# EasyEDA Pro project 2025-06-28（请勿使用）.epro, schematic Schematic1
Create Date: 2025-06-25; Page Name: P1; Project Name: ESP32S3-RS485-魔方机器人摄像头; Schematic Name: Schematic1; Update Date: 2025-06-27; Company: 嘉立创EDA; Page Size: A3; Version: V1.0
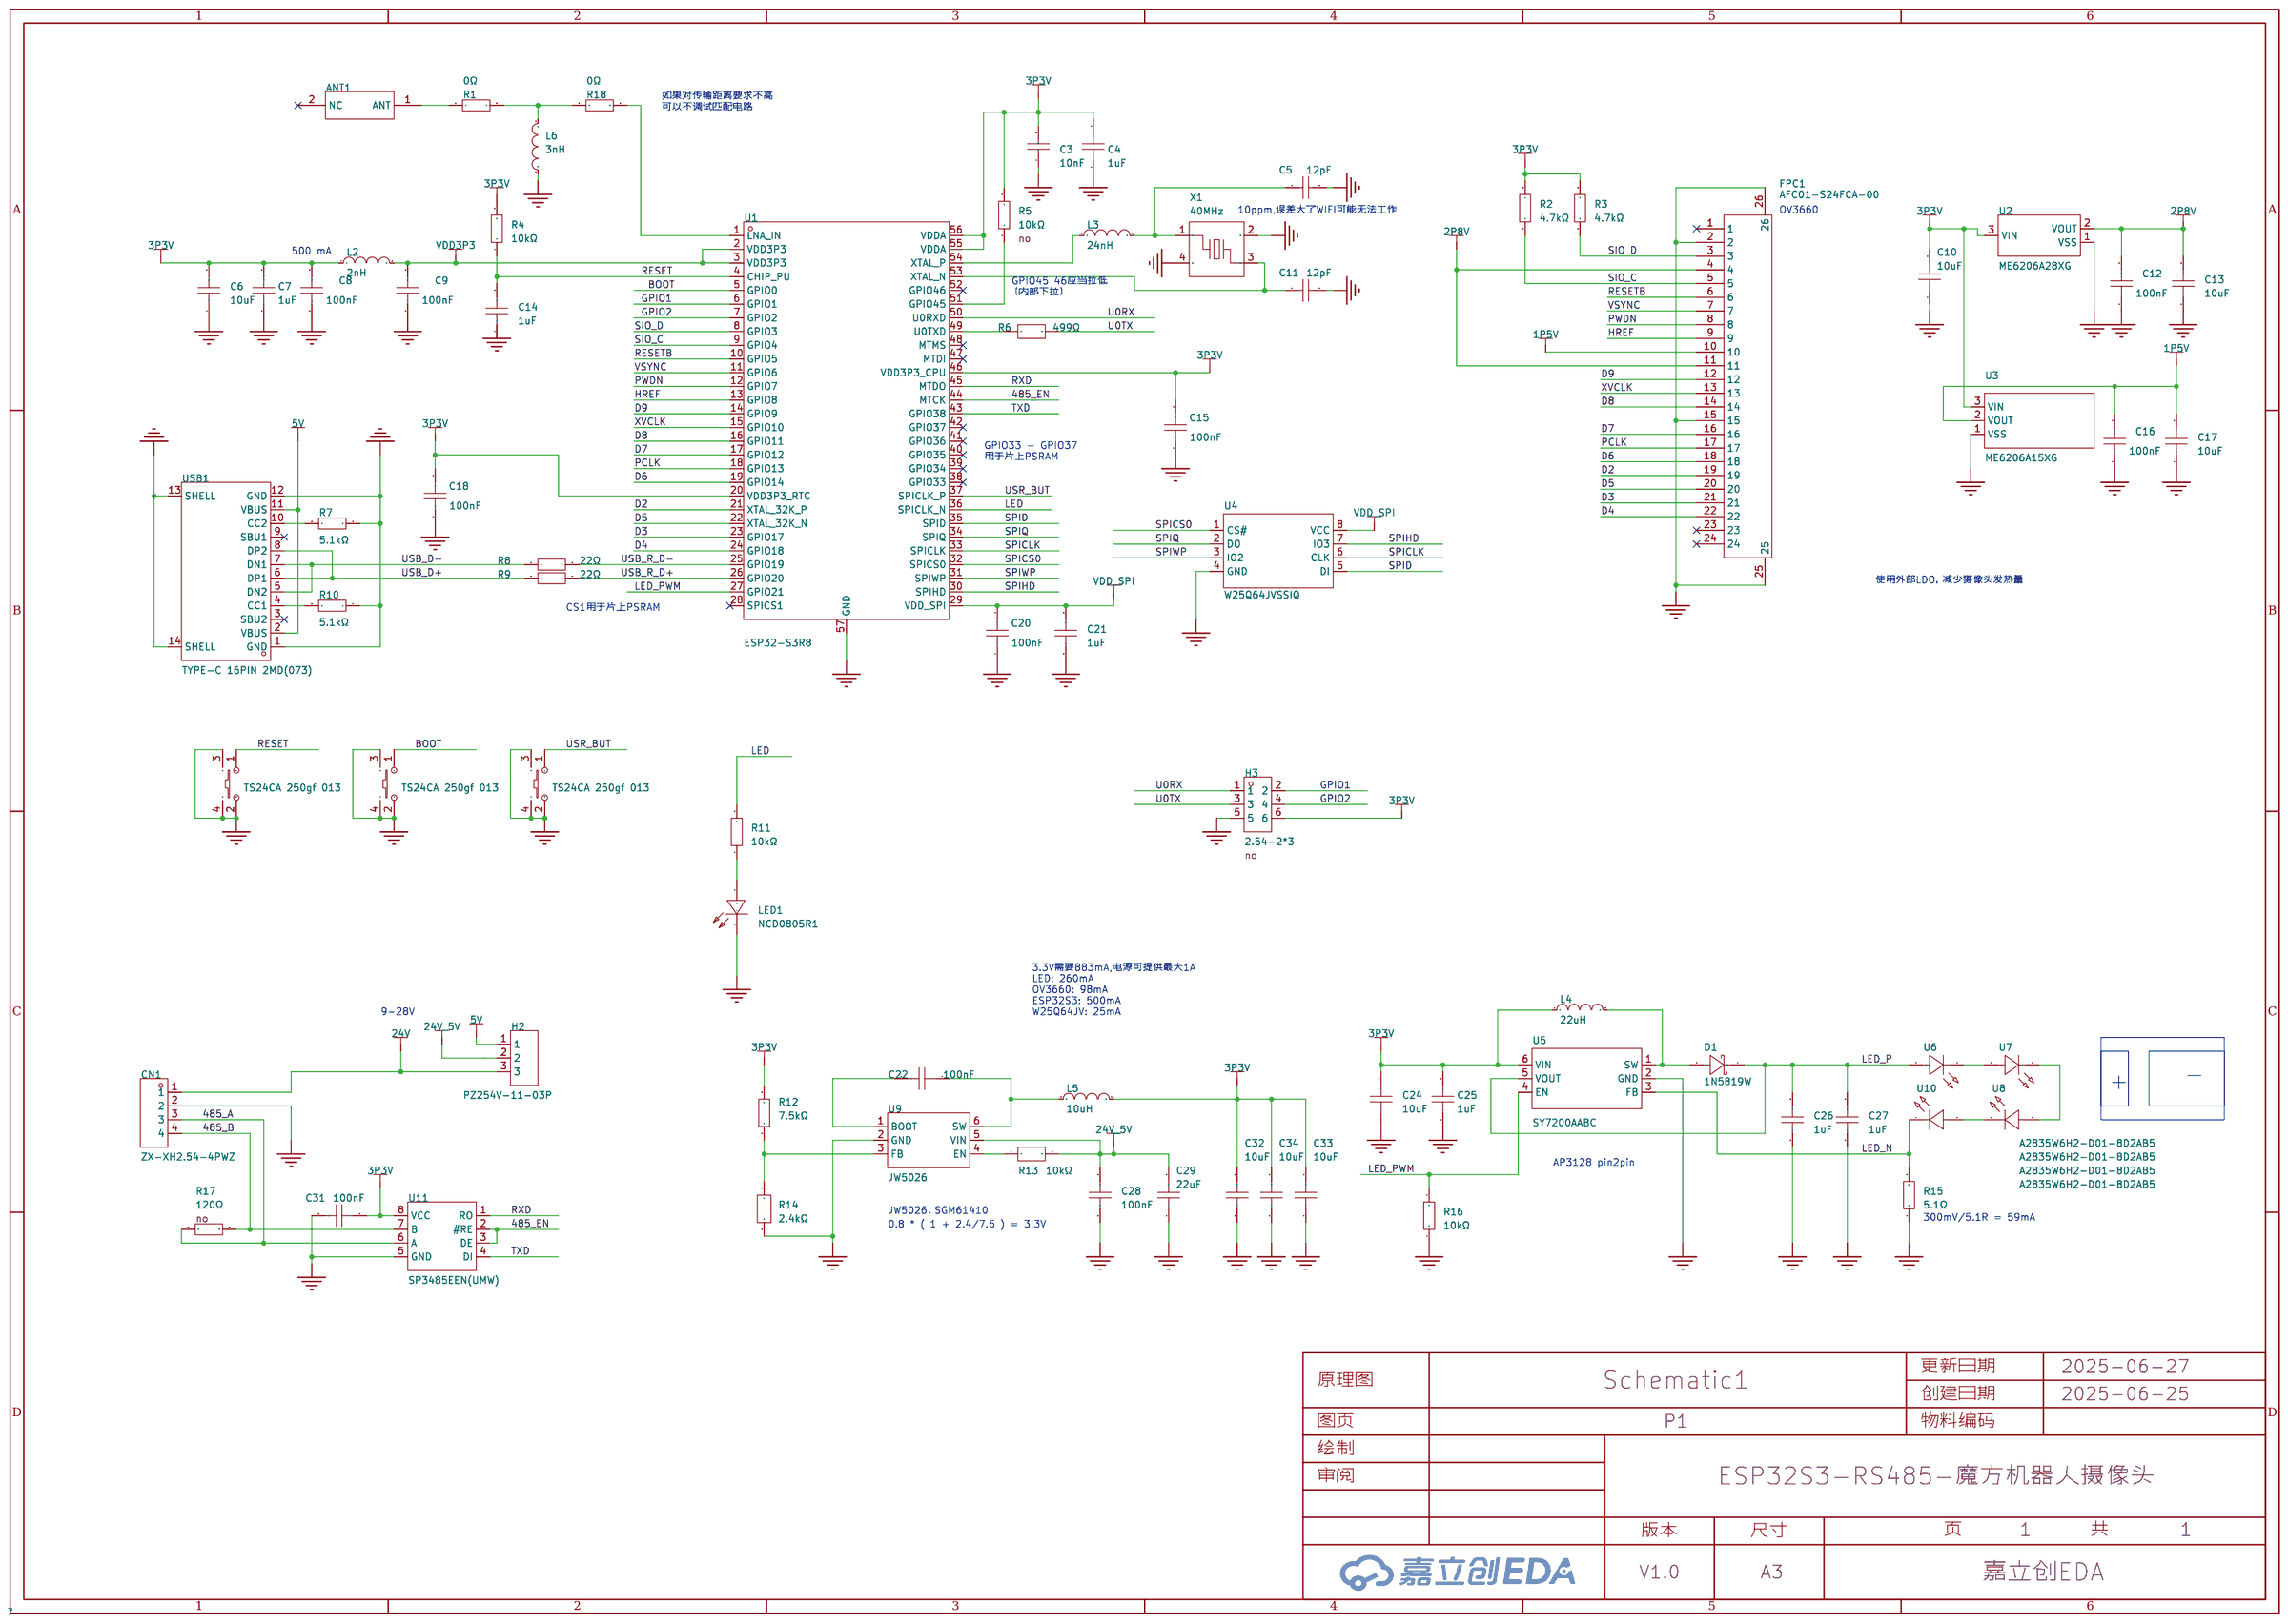
[diagram p0: schematic sheet]

## Parts
ANT1  -  [CA-C03]
C3  10nF  [C0603]
C4  1uF  [C0603]
C5  12pF  [C0603]
C6  10uF  [C0603]
C7  1uF  [C0603]
C8  100nF  [C0603]
C9  100nF  [C0603]
C10  10uF  [C0603]
C11  12pF  [C0603]
C12  100nF  [C0603]
C13  10uF  [C0603]
C14  1uF  [C0603]
C15  100nF  [C0603]
C16  100nF  [C0603]
C17  10uF  [C0603]
C18  100nF  [C0603]
C20  100nF  [C0603]
C21  1uF  [C0603]
C22  100nF  [C0603]
C24  10uF  [C0603]
C25  1uF  [C0603]
C26  1uF  [C0603]
C27  1uF  [C0603]
C28  100nF  [C0603]
C29  22uF  [C0805]
C31  100nF  [C0603]
C32  10uF  [C0603]
C33  10uF  [C0603]
C34  10uF  [C0603]
CN1  ZX-XH2.54-4PWZ  [CONN-TH_4P-P2.50_ZX-XH2.54-4PWZ]
D1  1N5819W  [SOD-123_L2.7-W1.6-LS3.7-RD]
FPC1  AFC01-S24FCA-00  [FPC-SMD_24P-P0.50_AFC01-S24FCA-00]
H2  PZ254V-11-03P  [HDR-TH_3P-P2.54-V-M]
H3  2.54-2*3  [HDR-TH_6P-P2.54-V-R2-C3-S2.54_A2541WV-2X3P]  (no BOM)
L2  2nH  [L0603]
L3  24nH  [IND-SMD_L1.6-W0.8]
L4  22uH  [IND-SMD_L4.0-W4.0]
L5  10uH  [IND-SMD_L4.0-W4.0_FNR40XXS]
L6  3nH  [L0402]
LED1  NCD0805R1  [LED0805-R-RD]
R1  0Ω  [R0402]
R2  4.7kΩ  [R0603]
R3  4.7kΩ  [R0603]
R4  10kΩ  [R0603]
R5  10kΩ  [R0603]  (no BOM)
R6  499Ω  [R0603]
R7  5.1kΩ  [R0603]
R8  22Ω  [R0603]
R9  22Ω  [R0603]
R10  5.1kΩ  [R0603]
R11  10kΩ  [R0603]
R12  7.5kΩ  [R0603]
R13  10kΩ  [R0603]
R14  2.4kΩ  [R0603]
R15  5.1Ω  [R0603]
R16  10kΩ  [R0603]
R17  120Ω  [R0603]  (no BOM)
R18  0Ω  [R0402]
SW1  TS24CA 250gf 013  [SW-SMD_L4.7-W3.5-P3.35-EH]
SW2  TS24CA 250gf 013  [SW-SMD_L4.7-W3.5-P3.35-EH]
SW3  TS24CA 250gf 013  [SW-SMD_L4.7-W3.5-P3.35-EH]
U1  ESP32-S3R8  [QFN-56_L7.0-W7.0-P0.40-TL-EP4.0]
U2  ME6206A28XG  [SOT-23_L2.9-W1.3-P1.90-LS2.4-BR]
U3  ME6206A15XG  [SOT-23-3_L2.9-W1.6-P1.90-LS2.8-BR]
U4  W25Q64JVSSIQ  [SOP-8_L5.3-W5.3-P1.27-LS8.0-BL]
U5  SY7200AABC  [SOT-23-6_L2.9-W1.6-P0.95-LS2.8-BR]
U6  A2835W6H2-D01-8D2AB5  [LED-SMD_L3.5-W2.8-FD-2835_WHITE]
U7  A2835W6H2-D01-8D2AB5  [LED-SMD_L3.5-W2.8-FD-2835_WHITE]
U8  A2835W6H2-D01-8D2AB5  [LED-SMD_L3.5-W2.8-FD-2835_WHITE]
U9  JW5026  [SOT-23-6_L2.9-W1.6-P0.95-LS2.8-BR]
U10  A2835W6H2-D01-8D2AB5  [LED-SMD_L3.5-W2.8-FD-2835_WHITE]
U11  SP3485EEN(UMW)  [SOP-8_L5.0-W4.0-P1.27-LS6.0-BL]
USB1  TYPE-C 16PIN 2MD(073)  [USB-C-SMD_TYPE-C-6PIN-2MD-073]
X1  40MHz  [CRYSTAL-SMD_4P-L3.2-W2.5-BL_SIT8008BI]

## Library data of the parts
ANT1 = CA-C03
C3 = 0603B103K500NT: 容值:10nF;精度:±10%;额定电压:50V;温度系数:X7R;; LCSC Part Name: 10nF ±10% 50V; Supplier Part: C57112; Manufacturer: FH(风华); Supplier Footprint: 0603; JLCPCB Part Class: 基础库; Datasheet: https://atta.szlcsc.com/upload/public/pdf/source/20200305/C486355_26A10D38EF8C2A5C37091D0039909270.pdf; Supplier: LCSC; Tolerance: ±10%; Voltage Rating: 50V; Temperature Coefficient: X7R
C4 C7 C14 C21 C25-C27 = CL10A105KB8NNNC: 容值:1uF;精度:±10%;额定电压:50V;材质(温度系数):X5R;; LCSC Part Name: 1uF ±10% 50V; Supplier Part: C15849; Manufacturer: SAMSUNG(三星); Supplier Footprint: 0603; JLCPCB Part Class: 基础库; Datasheet: https://atta.szlcsc.com/upload/public/pdf/source/20160218/1457707763339.pdf; Supplier: LCSC; Tolerance: ±10%; Voltage Rated: 50V; Temperature Coefficient: X5R
C5 C11 = CL10C120JB8NNNC: 容值:12pF;精度:±5%;额定电压:50V;材质(温度系数):C0G;; LCSC Part Name: 12pF ±5% 50V; Supplier Part: C38523; Manufacturer: SAMSUNG(三星); Supplier Footprint: 0603; JLCPCB Part Class: 基础库; Datasheet: https://atta.szlcsc.com/upload/public/pdf/source/20160218/1457707763339.pdf; Supplier: LCSC; Tolerance: ±5%; Voltage Rated: 50V; Temperature Coefficient: C0G
C6 C10 C13 C17 C24 C32-C34 = CL10A106KP8NNNC: 容值:10uF;精度:±10%;额定电压:10V;材质(温度系数):X5R;; LCSC Part Name: 10uF ±10% 10V; Supplier Part: C19702; Manufacturer: SAMSUNG(三星); Supplier Footprint: 0603; JLCPCB Part Class: 基础库; Datasheet: https://atta.szlcsc.com/upload/public/pdf/source/20160218/1457707763339.pdf; Supplier: LCSC; Tolerance: ±10%; Voltage Rated: 10V; Temperature Coefficient: X5R
C8 C9 C12 C15 C16 C18 C20 C22 C28 C31 = CC0603KRX7R9BB104: 容值:100nF;精度:±10%;额定电压:50V;材质(温度系数):X7R;; LCSC Part Name: 100nF ±10% 50V; Supplier Part: C14663; Manufacturer: YAGEO(国巨); Supplier Footprint: 0603; Datasheet: https://atta.szlcsc.com/upload/public/pdf/source/20180910/C282072_33301C7F631E79921B82A8DAC6BCC5B3.pdf; Supplier: LCSC; Tolerance: ±10%; Voltage Rated: 50V; Temperature Coefficient: X7R
C29 = CGA0805X5R226M350MT: 容值:22uF;精度:±20%;额定电压:35V;材质(温度系数):X5R;; LCSC Part Name: 22uF ±20% 35V; Supplier Part: C6119901; Manufacturer: HRE(芯声); Supplier Footprint: 0805; JLCPCB Part Class: 扩展库; Datasheet: https://atta.szlcsc.com/upload/public/pdf/source/20231129/D589D0CC4D260F7AC3A77E53B455CCB3.pdf; Supplier: LCSC; Tolerance: ±20%; Voltage Rated: 35V; Temperature Coefficient: X5R
CN1 = ZX-XH2.54-4PWZ: 插针结构:1x4P;间距:2.5mm;安装方式:弯插;参考系列:XH;总PIN数:4P;排数:1;每排PIN数:4;行距:-;额定电流:3A;触头材质:黄铜;触头镀层:锡;工作温度范围:-25℃~+85℃;; LCSC Part Name: 1x4P 间距:2.5mm 弯插 系列:XH; Supplier Part: C7429643; Manufacturer: Megastar(兆星); Supplier Footprint: 弯插,P=2.5mm; JLCPCB Part Class: 扩展库; Datasheet: https://atta.szlcsc.com/upload/public/pdf/source/20230619/8DC602C7BA46C153FF1BE89D90453879.pdf; Supplier: LCSC; Pins Structure: 1x4P; Pitch: 2.5mm; Mounting Type: 弯插; Reference Series: XH; Number of Pins: 4P; Number of Rows: 1; Number of PINs Per Row: 4; Rated Current: 3A; Contact Material: 黄铜; Contact Plating: 锡; Operating Temperature: -25℃~+85℃; Rated Voltage (Max): 250V; Plastic Material: PA66; Flame Retardant Rating: UL94V-0; Color: 白色; Z-Height of the Board: 5.9mm; X-Length of Bottom Edge on Board (Spacing Line): 12.5mm; Y-Width of Bottom Edge on Board: 7.32mm
D1 = 1N5819W_C963381: 二极管配置:独立式;正向压降(Vf):600mV@200mA;直流反向耐压(Vr):40V;整流电流:350mA;; LCSC Part Name: 电压:40V 电流:350mA; Supplier Part: C963381; Manufacturer: JSMSEMI(杰盛微); Supplier Footprint: SOD-123; JLCPCB Part Class: 扩展库; Datasheet: https://atta.szlcsc.com/upload/public/pdf/source/20230807/ADD53622154D5B572F84A7B877E922CE.pdf; Supplier: LCSC; Diode Configuration: 独立式; Forward Voltage (Vf@If): 600mV@200mA; Reverse Voltage (Vr): 40V; Rectified Current: 350mA; Reverse Leakage Current (Ir): 5uA@30V
FPC1 = AFC01-S24FCA-00: 锁定特性:翻盖式;触点类型:下接;触点数量:24P;间距:0.5mm;安装类型:卧贴;; LCSC Part Name: 间距:0.5mm P数:24P 翻盖式 下接; Supplier Part: C262669; Manufacturer: JS(钜硕电子); Supplier Footprint: SMD,P=0.5mm,卧贴; JLCPCB Part Class: 扩展库; Datasheet: https://atta.szlcsc.com/upload/public/pdf/source/20190816/C413942_2A72D1AC756EAE17EEDF756A339D4500.pdf; Supplier: LCSC; Locking Feature: 翻盖式; Contact Type: 下接; Number of Contacts: 24P; Pitch: 0.5mm; Mounting Type: 卧贴; FFC, FCB Thickness: 0.3mm; Height Above Board: 2mm
H2 = PZ254V-11-03P: 插针结构:1x3P;间距:2.54mm;行距:-;圆针/方针:方针;安装方式:直插;排数:单排;总PIN位数:3P;额定电流:3A;额定电压:250V;配合针长度:6mm;塑高:2.5mm;端接针长度:3mm;工作温度:-40℃~+105℃;颜色:黑色;; LCSC Part Name: 1x3P 间距:2.54mm 方针 直插; Supplier Part: C2937625; Manufacturer: XFCN(兴飞); Supplier Footprint: 插件,P=2.54mm; JLCPCB Part Class: 扩展库; Datasheet: https://atta.szlcsc.com/upload/public/pdf/source/20200309/C492402_8335C3D49C4E4C618838D59BB1D024C1.pdf; Supplier: LCSC; Pin Structure: 1x3P; Pitch: 2.54mm; Circluar Pins/Square Pins: 方针; Mounting Type: 直插; Number of Rows: 单排; Number of Pins: 3P; Current Rating: 3A; Voltage Rating (Max): 250V; Length of Mating Pin: 6mm; Insulation Height: 2.5mm; Length of End Connection Pin: 3mm; Operating Temperature: -40℃~+105℃; Color: 黑色
H3 = 2.54-2*3: 插针结构:2x3P;间距:2.54mm;排数:双排;总PIN位数:6P;; Supplier Part: C5116479; Manufacturer: ZHOURI(洲日); Supplier Footprint: 插件,P=2.54mm; JLCPCB Part Class: 扩展库; Datasheet: https://atta.szlcsc.com/upload/public/pdf/source/20220729/7A96040568D3A9F25ED0F1D4F891C529.pdf; Supplier: LCSC; Pin Structure: 2x3P; Pitch: 2.54mm; Number of Rows: 双排; Number of Pins: 6P
L2 = SDCL1608C2N0STDF: 电感值:2nH;额定电流:-;饱和电流(Isat):-;直流电阻(DCR):-;; Supplier Part: C370234; Manufacturer: Sunlord(顺络); Supplier Footprint: 0603; JLCPCB Part Class: 扩展库; Datasheet: https://atta.szlcsc.com/upload/public/pdf/source/20231027/6126A3AAC5912C34388756BE22DEE00C.pdf; Supplier: LCSC
L3 = LQW18AN24NG00D: 电感值:24nH;精度:±2%;额定电流:500mA;饱和电流(Isat):-;; LCSC Part Name: 24nH ±2%; Supplier Part: C162644; Manufacturer: muRata(村田); Supplier Footprint: 0603; JLCPCB Part Class: 扩展库; Datasheet: https://atta.szlcsc.com/upload/public/pdf/source/20180509/C162644_55649592C41EA1D19E6A8BFE8B8D1EC5.pdf; Supplier: LCSC; Tolerance: ±2%; Rated Current: 500mA; DC Resistance (DCR): 210mΩ
L4 = FHD4020S-220MT: 电感值:22uH;精度:±20%;额定电流:1.1A;饱和电流(Isat):1.5A;; LCSC Part Name: 22uH ±20% 1.5A; Supplier Part: C843299; Manufacturer: cjiang(长江微电); Supplier Footprint: SMD,4x4mm; JLCPCB Part Class: 扩展库; Datasheet: https://atta.szlcsc.com/upload/public/pdf/source/20200609/C601990_BCEA243EC4DA0A9A288AA78A6DFB48A5.pdf; Supplier: LCSC; Tolerance: ±20%; Rated Current: 1.1A; Saturation Current (Isat): 1.5A; DC Resistance (DCR): 415mΩ
L5 = FNR4030S100MT: 电感值:10uH;精度:±20%;额定电流:1.6A;饱和电流(Isat):2.4A;类型:磁胶屏蔽绕线合金电感;; LCSC Part Name: 10uH ±20% 2.4A; Supplier Part: C167879; Manufacturer: cjiang(长江微电); Supplier Footprint: SMD,4x4mm; JLCPCB Part Class: Extended Part; Datasheet: https://atta.szlcsc.com/upload/public/pdf/source/20190327/C167925_9EFF0AABC4CA629C2CC95961DBF7D39D.pdf; Supplier: LCSC; Tolerance: ±20%; Current Rating: 1.6A; Current - Saturation(Isat): 2.4A; DC Resistance(DCR): 130mΩ; Type: 磁胶屏蔽绕线合金电感; Rated Current: 1.1A; Saturation Current (Isat): 1.5A; DC Resistance (DCR): 415mΩ
L6 = LQG15HS3N0S02D: 电感值:3nH;精度:-;额定电流:800mA;饱和电流(Isat):-;直流电阻(DCR):125mΩ;; LCSC Part Name: 3nH ±0.3nH; Supplier Part: C19898; Manufacturer: muRata(村田); Supplier Footprint: 0402; JLCPCB Part Class: 扩展库; Datasheet: https://atta.szlcsc.com/upload/public/pdf/source/20190308/C133049_B485E2EE8D2287FEC07A8B24C0CCAD4A.pdf; Supplier: LCSC; Rated Current: 800mA; DC Resistance (DCR): 125mΩ; Q @ Freq: 8@100MHz; Frequency - Self Resonant: 6GHz
LED1 = NCD0805R1: 灯头类型:-;发光颜色:红色;正向电压(VF):1.6V~2.6V;功率:65mW;正向电流:20mA;主波长:615nm~630nm;二极管配置:独立二极管;透镜颜色:无色透明透镜;色温:-;发光强度:67mcd~195mcd;发光角度:130°;载带方式:-;工作温度:-30℃~+85℃;; Supplier Part: C84256; Manufacturer: 国星光电; Supplier Footprint: 0805; JLCPCB Part Class: 基础库; Datasheet: https://atta.szlcsc.com/upload/public/pdf/source/20200820/C84256_F0A75A43B3EAD75808600A0514C76B99.pdf; Supplier: LCSC; Emitted Color: 红色; Forward Voltage (VF): 1.6V~2.6V; Power Dissipation: 65mW; Forward Current: 20mA; Dominant Wavelength: 615nm~630nm; Diode Configuration: 独立二极管; Lens Color: 无色透明透镜; Luminous Intensity: 67mcd~195mcd; Viewing Angle: 130°; Operating Temperature: -30℃~+85℃
R1 R18 = 0402WGF0000TCE: 电阻类型:厚膜电阻;阻值:0Ω;精度:±1%;功率:62.5mW;最大工作电压:50V;温度系数:±800ppm/℃;; LCSC Part Name: 0Ω ±1% 62.5mW 厚膜电阻; Supplier Part: C17168; Manufacturer: UNI-ROYAL(厚声); Supplier Footprint: 0402; JLCPCB Part Class: 基础库; Datasheet: https://atta.szlcsc.com/upload/public/pdf/source/20200306/C422600_1E6D84923E4A46A82E41ADD87F860B5C.pdf; Supplier: LCSC; Type: 厚膜电阻; Tolerance: ±1%; Power(Watts): 62.5mW; Overload Voltage (Max): 50V; Temperature Coefficient: ±800ppm/℃; Operating Temperature Range: -55℃~+155℃
R2 R3 = 0603WAF4701T5E: 电阻类型:厚膜电阻;阻值:4.7kΩ;精度:±1%;功率:100mW;最大工作电压:75V;温度系数:±100ppm/℃;; LCSC Part Name: 4.7kΩ ±1% 100mW 厚膜电阻; Supplier Part: C23162; Manufacturer: UNI-ROYAL(厚声); Supplier Footprint: 0603; JLCPCB Part Class: 基础库; Datasheet: https://atta.szlcsc.com/upload/public/pdf/source/20200306/C422600_1E6D84923E4A46A82E41ADD87F860B5C.pdf; Supplier: LCSC; Type: 厚膜电阻; Tolerance: ±1%; Power(Watts): 100mW; Overload Voltage (Max): 75V; Temperature Coefficient: ±100ppm/℃; Operating Temperature Range: -55℃~+155℃
R4 R5 R11 R16 = 0603WAF1002T5E: 电阻类型:厚膜电阻;阻值:10kΩ;精度:±1%;功率:100mW;工作电压:75V;温度系数:±100ppm/℃;; LCSC Part Name: 厚膜电阻 10kΩ ±1% 100mW; Supplier Part: C25804; Manufacturer: UNI-ROYAL(厚声); Supplier Footprint: 0603; JLCPCB Part Class: 基础库; Datasheet: https://atta.szlcsc.com/upload/public/pdf/source/20200306/C422600_1E6D84923E4A46A82E41ADD87F860B5C.pdf; Supplier: LCSC; Type: 厚膜电阻; Tolerance: ±1%; Power(Watts): 100mW; Voltage-Supply(Max): 75V; Temperature Coefficient: ±100ppm/℃; Operating Temperature: -55℃~+155℃
R6 = FRC0603F4990TS: 电阻类型:厚膜电阻;阻值:499Ω;精度:±1%;功率:100mW;工作电压:75V;温度系数:±100ppm/℃;; LCSC Part Name: 499Ω ±1% 100mW 厚膜电阻; Supplier Part: C2933227; Manufacturer: FOJAN(富捷); Supplier Footprint: 0603; JLCPCB Part Class: 扩展库; Datasheet: https://atta.szlcsc.com/upload/public/pdf/source/20211221/925EC7D7225764EE0046F22065062C87.pdf; Supplier: LCSC; Type: 厚膜电阻; Tolerance: ±1%; Power(Watts): 100mW; Overload Voltage (Max): 75V; Temperature Coefficient: ±100ppm/℃; Operating Temperature: -55℃~+155℃
R7 R10 = 0603WAF5101T5E: 阻值:5.1kΩ;精度:±1%;功率:100mW;温度系数:±100ppm/℃;电阻类型:厚膜电阻;; LCSC Part Name: 5.1kΩ ±1% 100mW 厚膜电阻; Supplier Part: C23186; Manufacturer: UNI-ROYAL(厚声); Supplier Footprint: 0603; Datasheet: https://atta.szlcsc.com/upload/public/pdf/source/20200306/C422600_1E6D84923E4A46A82E41ADD87F860B5C.pdf; Supplier: LCSC; Tolerance: ±1%; Power(Watts): 100mW; Overload Voltage (Max): 75V; Temperature Coefficient: ±100ppm/℃; Type: 厚膜电阻; Operating Temperature Range: -55℃~+155℃
R8 R9 = 0603WAF220JT5E: 电阻类型:厚膜电阻;阻值:22Ω;精度:±1%;功率:100mW;最大工作电压:75V;温度系数:±100ppm/℃;; LCSC Part Name: 22Ω ±1% 100mW 厚膜电阻; Supplier Part: C23345; Manufacturer: UNI-ROYAL(厚声); Supplier Footprint: 0603; JLCPCB Part Class: Basic Part; Datasheet: https://atta.szlcsc.com/upload/public/pdf/source/20200306/C422600_1E6D84923E4A46A82E41ADD87F860B5C.pdf; Supplier: LCSC; Type: 厚膜电阻; Tolerance: ±1%; Power(Watts): 100mW; Overload Voltage (Max): 75V; Temperature Coefficient: ±100ppm/℃; Operating Temperature Range: -55℃~+155℃
R12 = 0603WAF7501T5E: 电阻类型:厚膜电阻;阻值:7.5kΩ;精度:±1%;功率:100mW;最大工作电压:75V;温度系数:±100ppm/℃;; LCSC Part Name: 7.5kΩ ±1% 100mW 厚膜电阻; Supplier Part: C23234; Manufacturer: UNI-ROYAL(厚声); Supplier Footprint: 0603; JLCPCB Part Class: Basic Part; Datasheet: https://atta.szlcsc.com/upload/public/pdf/source/20200306/C422600_1E6D84923E4A46A82E41ADD87F860B5C.pdf; Supplier: LCSC; Type: 厚膜电阻; Tolerance: ±1%; Power(Watts): 100mW; Overload Voltage (Max): 75V; Temperature Coefficient: ±100ppm/℃; Operating Temperature Range: -55℃~+155℃
R13 = AT0603BRD0710KL: 电阻类型:薄膜电阻;阻值:10kΩ;精度:±0.1%;功率:100mW;; LCSC Part Name: 10kΩ ±0.1% 100mW; Supplier Part: C723396; Manufacturer: YAGEO(国巨); Supplier Footprint: 0603; JLCPCB Part Class: 扩展库; Datasheet: https://atta.szlcsc.com/upload/public/pdf/source/20200722/C705051_EA338A836C78FCD1C867566BE6F43B3A.pdf; Supplier: LCSC; Type: 薄膜电阻; Tolerance: ±0.1%; Power(Watts): 100mW; Temperature Coefficient: ±25ppm/℃; Overload Voltage (Max): 75V; Operating Temperature Range: -55℃~+155℃
R14 = FRC0603F2401TS: 电阻类型:厚膜电阻;阻值:2.4kΩ;精度:±1%;功率:100mW;工作电压:75V;温度系数:±100ppm/℃;; LCSC Part Name: 2.4kΩ ±1% 100mW 厚膜电阻; Supplier Part: C2907007; Manufacturer: FOJAN(富捷); Supplier Footprint: 0603; JLCPCB Part Class: Extended Part; Datasheet: https://atta.szlcsc.com/upload/public/pdf/source/20211221/925EC7D7225764EE0046F22065062C87.pdf; Supplier: LCSC; Type: 厚膜电阻; Tolerance: ±1%; Power(Watts): 100mW; Voltage-Supply(Max): 75V; Temperature Coefficient: ±100ppm/℃; Operating Temperature: -55℃~+155℃; Overload Voltage (Max): 75V; Operating Temperature Range: -55℃~+155℃
R15 = 0603WAF510KT5E: 电阻类型:厚膜电阻;阻值:5.1Ω;精度:±1%;功率:100mW;最大工作电压:75V;温度系数:±200ppm/℃;; LCSC Part Name: 5.1Ω ±1% 100mW 厚膜电阻; Supplier Part: C25197; Manufacturer: UNI-ROYAL(厚声); Supplier Footprint: 0603; JLCPCB Part Class: 基础库; Datasheet: https://atta.szlcsc.com/upload/public/pdf/source/20200306/C422600_1E6D84923E4A46A82E41ADD87F860B5C.pdf; Supplier: LCSC; Type: 厚膜电阻; Tolerance: ±1%; Power(Watts): 100mW; Overload Voltage (Max): 75V; Temperature Coefficient: ±200ppm/℃; Operating Temperature Range: -55℃~+155℃
R17 = 0603WAF1200T5E: 电阻类型:厚膜电阻;阻值:120Ω;精度:±1%;功率:100mW;最大工作电压:75V;温度系数:±100ppm/℃;; LCSC Part Name: 120Ω ±1% 100mW 厚膜电阻; Supplier Part: C22787; Manufacturer: UNI-ROYAL(厚声); Supplier Footprint: 0603; JLCPCB Part Class: 基础库; Datasheet: https://atta.szlcsc.com/upload/public/pdf/source/20200306/C422600_1E6D84923E4A46A82E41ADD87F860B5C.pdf; Supplier: LCSC; Type: 厚膜电阻; Tolerance: ±1%; Power(Watts): 100mW; Overload Voltage (Max): 75V; Temperature Coefficient: ±100ppm/℃; Operating Temperature Range: -55℃~+155℃
SW1-SW3 = TS24CA 250gf 013: 电路结构:单刀单掷;按钮形状:矩形按钮;作用力:250gf;安装方式:卧贴;开关长度:4.55mm;开关宽度:1.8mm;开关高度:3.5mm;带支架:不带;触点电流:50mA;额定电压(AC):-;额定电压(DC):12V;额定功率:0.6W;绝缘电阻:100MΩ;带灯:无;机械寿命:3万次;; LCSC Part Name: 2*4*3.5mm半包小贝贝TS-018小侧按键m165蓝牙耳机开关 250gf; Supplier Part: C5373430; Manufacturer: SHOU HAN(首韩); Supplier Footprint: SMD; JLCPCB Part Class: 扩展库; Datasheet: https://atta.szlcsc.com/upload/public/pdf/source/20230321/913029B0FB0CD391AF5EFD51697D8EC4.pdf; Supplier: LCSC; Circuit: 单刀单掷; Actuator Style: 矩形按钮; Operating Force: 250gf; Mounting Style: 卧贴; Switch Length: 4.55mm; Switch Width: 1.8mm; Switch Height: 3.5mm; Strike Gundam: 不带; Contact Current: 50mA; Voltage Rating (DC): 12V; Power Rating: 0.6W; Insulation Resistance: 100MΩ; Actuator/Cap Color: 黑色; With Lamp: 无; Mechanical Life: 3万次; Operating Temperature: -40℃~+85℃
U1 = ESP32-S3R8: 频率范围:2.412GHz~2.484GHz;接口类型:I2C；I2S；UART；USB；SPI;应用领域:蓝牙；IoT；WiFi;数据速率:150Mbps;灵敏度:-74.2dBm;典型应用频率:2.4GHz;; Supplier Part: C2913194; Manufacturer: ESPRESSIF(乐鑫); Supplier Footprint: QFN-56(7x7); JLCPCB Part Class: 扩展库; Datasheet: https://atta.szlcsc.com/upload/public/pdf/source/20231007/CDA236FFCB3F25B7D5220D2CA9867287.pdf; Supplier: LCSC; Frequency Range: 2.412GHz~2.484GHz; Interface: I2C；I2S；UART；USB；SPI; Voltage - Supply: 3V~3.6V; Applications: 蓝牙；IoT；WiFi; Output Power: 18.5dBm; Data Rate: 150Mbps; Current Of Transmitting: 283mA; Sensitivity: -74.2dBm; Receive Current: 88mA; Typical Application Frequency: 2.4GHz; Operating Temperature: -40℃~+65℃
U2 = ME6206A28XG: 输出类型:固定;工作电压:6V;输出电压:2.8V;输出电流:300mA;电源纹波抑制比(PSRR):50dB@(1kHz);输出极性:正极;; LCSC Part Name: 输入6V 输出2.8V 300mA; Supplier Part: C236702; Manufacturer: MICRONE(南京微盟); Supplier Footprint: SOT-23; JLCPCB Part Class: Extended Part; Datasheet: https://atta.szlcsc.com/upload/public/pdf/source/20180709/C236710_17D59B8921B23E717C74E2DD8882F2F4.pdf; Supplier: LCSC; Output Type: 固定; Voltage - Supply: 6V; Output Voltage: 2.8V; Output Current: 300mA; Power Supply Rejection Ratio (PSRR): 50dB@(1kHz); Voltage Dropout: 400mV@(200mA); Features: 短路保护(SCP)；过流保护(OCP); Output Configuration: 正极; Number of Outputs: 1
U3 = ME6206A15XG: 输出类型:固定;工作电压:6V;输出电压:1.5V;输出电流:100mA;电源纹波抑制比(PSRR):45dB@(1kHz);输出极性:正极;; LCSC Part Name: 输入6V 输出1.5V 100mA; Supplier Part: C236709; Manufacturer: MICRONE(南京微盟); Supplier Footprint: SOT-23; JLCPCB Part Class: 扩展库; Datasheet: https://atta.szlcsc.com/upload/public/pdf/source/20180709/C236710_17D59B8921B23E717C74E2DD8882F2F4.pdf; Supplier: LCSC; Output Type: 固定; Voltage - Supply: 6V; Output Voltage: 1.5V; Output Current: 100mA; Power Supply Rejection Ratio (PSRR): 45dB@(1kHz); Voltage Dropout: 380mV@(50mA); Features: 短路保护(SCP)；过流保护(OCP); Output Configuration: 正极; Number of Outputs: 1
U4 = W25Q64JVSSIQ_C83140: 接口类型:SPI;存储容量:-;时钟频率(fc):133MHz;; Supplier Part: C83140; Manufacturer: WINBOND(华邦); Supplier Footprint: SOP-8-208mil; JLCPCB Part Class: 扩展库; Datasheet: https://atta.szlcsc.com/upload/public/pdf/source/20161110/1478742546019.pdf; Supplier: LCSC; Interface: SPI; Clock Frequency: 133MHz; Voltage - Supply: 3V~3.6V; Page Programming Time (Tpp): 3ms; Data Retention - TDR (Year): 20年
U5 = SY7200AABC: 开关频率:1MHz;通道数:1;输出电流:2A;调光:PWM;拓扑结构:升压;; Supplier Part: C107309; Manufacturer: silergy(矽力杰); Supplier Footprint: SOT-23-6; JLCPCB Part Class: Extended Part; Datasheet: https://atta.szlcsc.com/upload/public/pdf/source/20170925/C107309_1506321334417990079.pdf; Supplier: LCSC; Frequency - Switching: 1MHz; Number of Channels: 1; Output Current: 2A; Dimming: PWM; Topology: 升压; Operating temperature: -40℃~+85℃; Voltage - Input: 2.5V~5.5V
U6-U8 U10 = A2835W6H2-D01-8D2AB5: 发光颜色:白色;正向电压(VF):2.9V~3.3V;正向电流:-;色温:6500K;; LCSC Part Name: 2835正白光6000-7000K; Supplier Part: C7423447; Manufacturer: HONGLITRONIC(鸿利光电); Supplier Footprint: SMD2835; JLCPCB Part Class: Extended Part; Datasheet: https://atta.szlcsc.com/upload/public/pdf/source/20230608/811871640B6DA35415197D15B0ECD5AB.pdf; Supplier: LCSC; Emitted Color: 白色; Forward Voltage (VF): 2.9V~3.3V; Color Temperature: 6500K
U9 = JW5026: 功能类型:降压型;输出类型:可调;工作电压:4.7V~40V;输出电压:800mV~37V;输出电流:1A;; LCSC Part Name: 40V/1A 1.1MHz 同步降压转换器; Supplier Part: C185109; Manufacturer: Joulwatt(杰华特); Supplier Footprint: SOT-23-6; JLCPCB Part Class: Extended Part; Datasheet: https://atta.szlcsc.com/upload/public/pdf/source/20240411/D05DCDB5FDCEDE426B2091AA7B7ABBD9.pdf; Supplier: LCSC; Function: 降压型; Output Type: 可调; Voltage - Supply: 4.7V~40V; Output Voltage: 800mV~37V; Output Current: 1A; Frequency - Switching: 750kHz~1.25MHz; Operating Temperature: -40℃~+125℃@(TJ); Synchronous Rectifier: 是; Number of Outputs: 1; Topology: 降压式; Switch tube (built-in/external): 内置
U11 = SP3485EEN(UMW): 类型:收发器;数据速率:12Mbps;; LCSC Part Name: SP3485E 3.3V电源，最多256个节点，12Mbps半双工，RS485/RS422收发器; Supplier Part: C668205; Manufacturer: UMW(友台半导体); Supplier Footprint: SOP-8; JLCPCB Part Class: 扩展库; Datasheet: https://atta.szlcsc.com/upload/public/pdf/source/20240223/FED69C9FF7082854C69A701499F648A3.pdf; Supplier: LCSC; Types: 收发器; Number of Driver: 1; Number of receiver: 1; Supply Voltage: 2.97V~3.63V; Data Rate: 12Mbps; Operating Temperature: -40℃~+85℃
USB1 = TYPE-C 16PIN 2MD(073): 连接器类型:Type-C;标准:-;公母:母;触点数量:16P;端口数量:1;安装方式:卧贴;额定电流 - 电源:5A;工作温度范围:-25℃~+85℃;; LCSC Part Name: Type-C 母 卧贴 带定位柱 不锈钢外壳 2次模顶; Supplier Part: C2765186; Manufacturer: SHOU HAN(首韩); Supplier Footprint: SMD; JLCPCB Part Class: 扩展库; Datasheet: https://atta.szlcsc.com/upload/public/pdf/source/20211123/39B17C16241EAC15C5E277BDA434118E.pdf; Supplier: LCSC; Connector Type: Type-C; Gender: 母; Number of Contacts: 16P; Number of Ports: 1; Mounting Style: 卧贴; Current Rating - Power (Max): 5A; Operating Temperature Range: -25℃~+85℃
X1 = CF4040M00010001: 晶振类型:贴片晶振;频率:40MHz;常温频差:±10ppm;负载电容:10pF;频率稳定度:±30ppm;; LCSC Part Name: 40MHz ±10ppm 10pF; Supplier Part: C7294598; Manufacturer: HUAXIN(华昕); Supplier Footprint: SMD3225-4P; JLCPCB Part Class: Extended Part; Datasheet: https://atta.szlcsc.com/upload/public/pdf/source/20230621/E84B4CBBD03DBFE94C04DF39FCA92073.pdf; Supplier: LCSC; Type: 贴片晶振; Normal temperature Frequency Tolerance: ±10ppm; Load Capacitance: 10pF; Frequency Stability: ±30ppm; Equivalent Series Resistance(ESR): 40Ω; Operating Temperature: -40℃~+85℃

## Nets
5V: H2.1 USB1.2(VBUS) USB1.11(VBUS)
24V: CN1.1 H2.3
24V_5V: C28.1 C29.2 H2.2 R13.2 U9.5(VIN)
GND: C3.1 C4.1 C5.2 C6.1 C7.1 C8.1 C9.1 C10.1 C11.1 C12.1 C13.1 C14.1 C15.1 C16.1 C17.1 C18.1 C20.1 C21.1 C24.1 C25.1 C26.1 C27.1 C28.2 C29.1 C31.2 C32.1 C33.1 C34.1 CN1.2 FPC1.2 FPC1.15 FPC1.25 FPC1.26 H3.5 L6.1 LED1.2(-) R7.1 R10.1 R14.1 R15.1 R16.1 SW1.2 SW1.3 SW1.4 SW2.2 SW2.3 SW2.4 SW3.2 SW3.3 SW3.4 U1.57(GND) U2.1(VSS) U3.1(VSS) U4.4(GND) U5.2(GND) U9.2(GND) U11.5(GND) USB1.1(GND) USB1.12(GND) USB1.13(SHELL) USB1.14(SHELL) X1.2(GND) X1.4(GND)
VDD3P3: C9.2 L2.2 U1.2(VDD3P3) U1.3(VDD3P3)
VDD_SPI: C20.2 C21.2 U1.29(VDD_SPI) U4.8(VCC)
1P5V: C16.2 C17.2 FPC1.10 U3.2(VOUT)
2P8V: C12.2 C13.2 FPC1.4 FPC1.11 U2.2(VOUT)
3P3V: C3.2 C4.2 C6.2 C7.2 C8.2 C10.2 C15.2 C18.2 C24.2 C25.2 C31.1 C32.2 C33.2 C34.2 H3.6 L2.1 L4.1 L5.2 R2.2 R3.2 R4.2 R5.2 R12.2 U1.20(VDD3P3_RTC) U1.46(VDD3P3_CPU) U1.55(VDDA) U1.56(VDDA) U2.3(VIN) U3.3(VIN) U5.6(VIN) U11.8(VCC)
485_A: CN1.3 R17.1 U11.6(A)
485_B: CN1.4 R17.2 U11.7(B)
485_EN: U1.44(MTCK) U11.2(#RE) U11.3(DE)
BOOT: SW2.1 U1.5(GPIO0)
D2: FPC1.19 U1.21(XTAL_32K_P)
D3: FPC1.21 U1.23(GPIO17)
D4: FPC1.22 U1.24(GPIO18)
D5: FPC1.20 U1.22(XTAL_32K_N)
D6: FPC1.18 U1.19(GPIO14)
D7: FPC1.16 U1.17(GPIO12)
D8: FPC1.14 U1.16(GPIO11)
D9: FPC1.12 U1.14(GPIO9)
GPIO1: H3.2 U1.6(GPIO1)
GPIO2: H3.4 U1.7(GPIO2)
HREF: FPC1.9 U1.13(GPIO8)
LED: R11.2 U1.36(SPICLK_N)
LED_N: R15.2 U5.3(FB) U10.1(K)
LED_P: C26.2 C27.2 D1.1(C) U5.5(VOUT) U6.2(A)
LED_PWM: R16.2 U1.27(GPIO21) U5.4(EN)
PCLK: FPC1.17 U1.18(GPIO13)
PWDN: FPC1.8 U1.12(GPIO7)
RESET: C14.2 R4.1 SW1.1 U1.4(CHIP_PU)
RESETB: FPC1.6 U1.10(GPIO5)
RXD: U1.45(MTDO) U11.1(RO)
SIO_C: FPC1.5 R2.1 U1.9(GPIO4)
SIO_D: FPC1.3 R3.1 U1.8(GPIO3)
SPICLK: U1.33(SPICLK) U4.6(CLK)
SPICS0: U1.32(SPICS0) U4.1(CS#)
SPID: U1.35(SPID) U4.5(DI)
SPIHD: U1.30(SPIHD) U4.7(IO3)
SPIQ: U1.34(SPIQ) U4.2(DO)
SPIWP: U1.31(SPIWP) U4.3(IO2)
TXD: U1.43(GPIO38) U11.4(DI)
U0RX: H3.1 U1.50(U0RXD)
U0TX: H3.3 R6.2
USB_D+: R9.1 USB1.6(DP1) USB1.8(DP2)
USB_D-: R8.1 USB1.5(DN2) USB1.7(DN1)
USB_R_D+: R9.2 U1.26(GPIO20)
USB_R_D-: R8.2 U1.25(GPIO19)
USR_BUT: SW3.1 U1.37(SPICLK_P)
VSYNC: FPC1.7 U1.11(GPIO6)
XVCLK: FPC1.13 U1.15(GPIO10)
$1N788: R7.2 USB1.10(CC2)
$1N789: R10.2 USB1.4(CC1)
$1N1772: L3.1 U1.54(XTAL_P)
$1N1802: C11.2 U1.53(XTAL_N) X1.3
$1N1812: C5.1 L3.2 X1.1
$1N4260: R5.1 U1.51(GPIO45)
$1N4634: R6.1 U1.49(U0TXD)
$1N5382: ANT1.1(ANT) R1.1
$1N7842: R13.1 U9.4(EN)
$1N7844: C22.1 L5.1 U9.6(SW)
$1N7845: C22.2 U9.1(BOOT)
$1N8031: R12.1 R14.2 U9.3(FB)
$1N9498: D1.2(A) L4.2 U5.1(SW)
$1N9979: U7.1(K) U8.2(A)
$1N9982: U6.1(K) U7.2(A)
$1N9996: U8.1(K) U10.2(A)
$1N10529: LED1.1(+) R11.1
$1N11616: R18.2 U1.1(LNA_IN)
$1N11617: L6.2 R1.2 R18.1

Not connected (* = marked no-connect by the designer): ANT1 2(NC)*; FPC1 1* 23* 24*; U1 28(SPICS1)* 38(GPIO33)* 39(GPIO34)* 40(GPIO35)* 41(GPIO36)* 42(GPIO37)* 47(MTDI)* 48(MTMS)* 52(GPIO46)*; USB1 3(SBU2)* 9(SBU1)*

## Notes on the sheet
- 如果对传输距离要求不高
  可以不调试匹配电路
- 10ppm,误差大了WIFI可能无法工作
- OV3660
- 500 mA
- GPIO45 46应当拉低
  （内部下拉）
- GPIO33 - GPIO37
  用于片上PSRAM
- 使用外部LDO，减少摄像头发热量
- CS1用于片上PSRAM
- 9-28V
- 3.3V需要883mA,电源可提供最大1A
  LED: 260mA
  OV3660: 98mA
  ESP32S3: 500mA
  W25Q64JV: 25mA
- -
- +
- AP3128 pin2pin
- 0.8 * ( 1 + 2.4/7.5 ) = 3.3V
- JW5026、SGM61410
- 300mV/5.1R = 59mA
